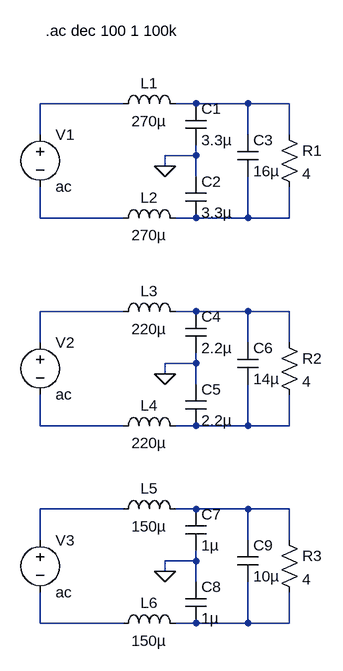
[diagram p0: schematic output_filter.asc]
output_filter.asc, the LTspice schematic file:
Version 4
SHEET 1 1112 940
WIRE 304 96 176 96
WIRE 416 96 384 96
WIRE 496 96 416 96
WIRE 560 96 496 96
WIRE 176 144 176 96
WIRE 496 144 496 96
WIRE 560 144 560 96
WIRE 416 176 416 160
WIRE 416 176 368 176
WIRE 368 192 368 176
WIRE 416 208 416 176
WIRE 176 272 176 224
WIRE 304 272 176 272
WIRE 416 272 384 272
WIRE 496 272 496 208
WIRE 496 272 416 272
WIRE 560 272 560 224
WIRE 560 272 496 272
WIRE 304 416 176 416
WIRE 416 416 384 416
WIRE 496 416 416 416
WIRE 560 416 496 416
WIRE 176 464 176 416
WIRE 496 464 496 416
WIRE 560 464 560 416
WIRE 416 496 416 480
WIRE 416 496 368 496
WIRE 368 512 368 496
WIRE 416 528 416 496
WIRE 176 592 176 544
WIRE 304 592 176 592
WIRE 416 592 384 592
WIRE 496 592 496 528
WIRE 496 592 416 592
WIRE 560 592 560 544
WIRE 560 592 496 592
WIRE 304 720 176 720
WIRE 416 720 384 720
WIRE 496 720 416 720
WIRE 560 720 496 720
WIRE 176 768 176 720
WIRE 496 768 496 720
WIRE 560 768 560 720
WIRE 416 800 416 784
WIRE 416 800 368 800
WIRE 368 816 368 800
WIRE 416 832 416 800
WIRE 176 896 176 848
WIRE 304 896 176 896
WIRE 416 896 384 896
WIRE 496 896 496 832
WIRE 496 896 416 896
WIRE 560 896 560 848
WIRE 560 896 496 896
FLAG 368 192 0
FLAG 368 512 0
FLAG 368 816 0
SYMBOL ind 288 112 R270
WINDOW 0 32 56 VTop 2
WINDOW 3 5 56 VBottom 2
SYMATTR InstName L1
SYMATTR Value 270µ
SYMBOL ind 288 288 R270
WINDOW 0 32 56 VTop 2
WINDOW 3 5 56 VBottom 2
SYMATTR InstName L2
SYMATTR Value 270µ
SYMBOL cap 400 96 R0
SYMATTR InstName C1
SYMATTR Value 3.3µ
SYMBOL cap 400 208 R0
SYMATTR InstName C2
SYMATTR Value 3.3µ
SYMBOL cap 480 144 R0
SYMATTR InstName C3
SYMATTR Value 16µ
SYMBOL res 544 128 R0
SYMATTR InstName R1
SYMATTR Value 4
SYMBOL voltage 176 128 R0
WINDOW 123 0 0 Left 0
WINDOW 39 0 0 Left 0
SYMATTR InstName V1
SYMATTR Value ac
SYMBOL ind 288 432 R270
WINDOW 0 32 56 VTop 2
WINDOW 3 5 56 VBottom 2
SYMATTR InstName L3
SYMATTR Value 220µ
SYMBOL ind 288 608 R270
WINDOW 0 32 56 VTop 2
WINDOW 3 5 56 VBottom 2
SYMATTR InstName L4
SYMATTR Value 220µ
SYMBOL cap 400 416 R0
SYMATTR InstName C4
SYMATTR Value 2.2µ
SYMBOL cap 400 528 R0
SYMATTR InstName C5
SYMATTR Value 2.2µ
SYMBOL cap 480 464 R0
SYMATTR InstName C6
SYMATTR Value 14µ
SYMBOL res 544 448 R0
SYMATTR InstName R2
SYMATTR Value 4
SYMBOL voltage 176 448 R0
WINDOW 123 0 0 Left 0
WINDOW 39 0 0 Left 0
SYMATTR InstName V2
SYMATTR Value ac
SYMBOL ind 288 736 R270
WINDOW 0 32 56 VTop 2
WINDOW 3 5 56 VBottom 2
SYMATTR InstName L5
SYMATTR Value 150µ
SYMBOL ind 288 912 R270
WINDOW 0 32 56 VTop 2
WINDOW 3 5 56 VBottom 2
SYMATTR InstName L6
SYMATTR Value 150µ
SYMBOL cap 400 720 R0
SYMATTR InstName C7
SYMATTR Value 1µ
SYMBOL cap 400 832 R0
SYMATTR InstName C8
SYMATTR Value 1µ
SYMBOL cap 480 768 R0
SYMATTR InstName C9
SYMATTR Value 10µ
SYMBOL res 544 752 R0
SYMATTR InstName R3
SYMATTR Value 4
SYMBOL voltage 176 752 R0
WINDOW 123 0 0 Left 0
WINDOW 39 0 0 Left 0
SYMATTR InstName V3
SYMATTR Value ac
TEXT 184 -16 Left 2 !.ac dec 100 1 100k

The netlist it stands for:
* output_filter.asc
L1 N001 N002 270µ
L2 N003 N004 270µ
C1 N002 0 3.3µ
C2 0 N004 3.3µ
C3 N002 N004 16µ
R1 N002 N004 4
V1 N001 N003 ac
L3 N005 N006 220µ
L4 N007 N008 220µ
C4 N006 0 2.2µ
C5 0 N008 2.2µ
C6 N006 N008 14µ
R2 N006 N008 4
V2 N005 N007 ac
L5 N009 N010 150µ
L6 N011 N012 150µ
C7 N010 0 1µ
C8 0 N012 1µ
C9 N010 N012 10µ
R3 N010 N012 4
V3 N009 N011 ac
.ac dec 100 1 100k
.backanno
.end